# Altium project DragonFly.PrjPcb
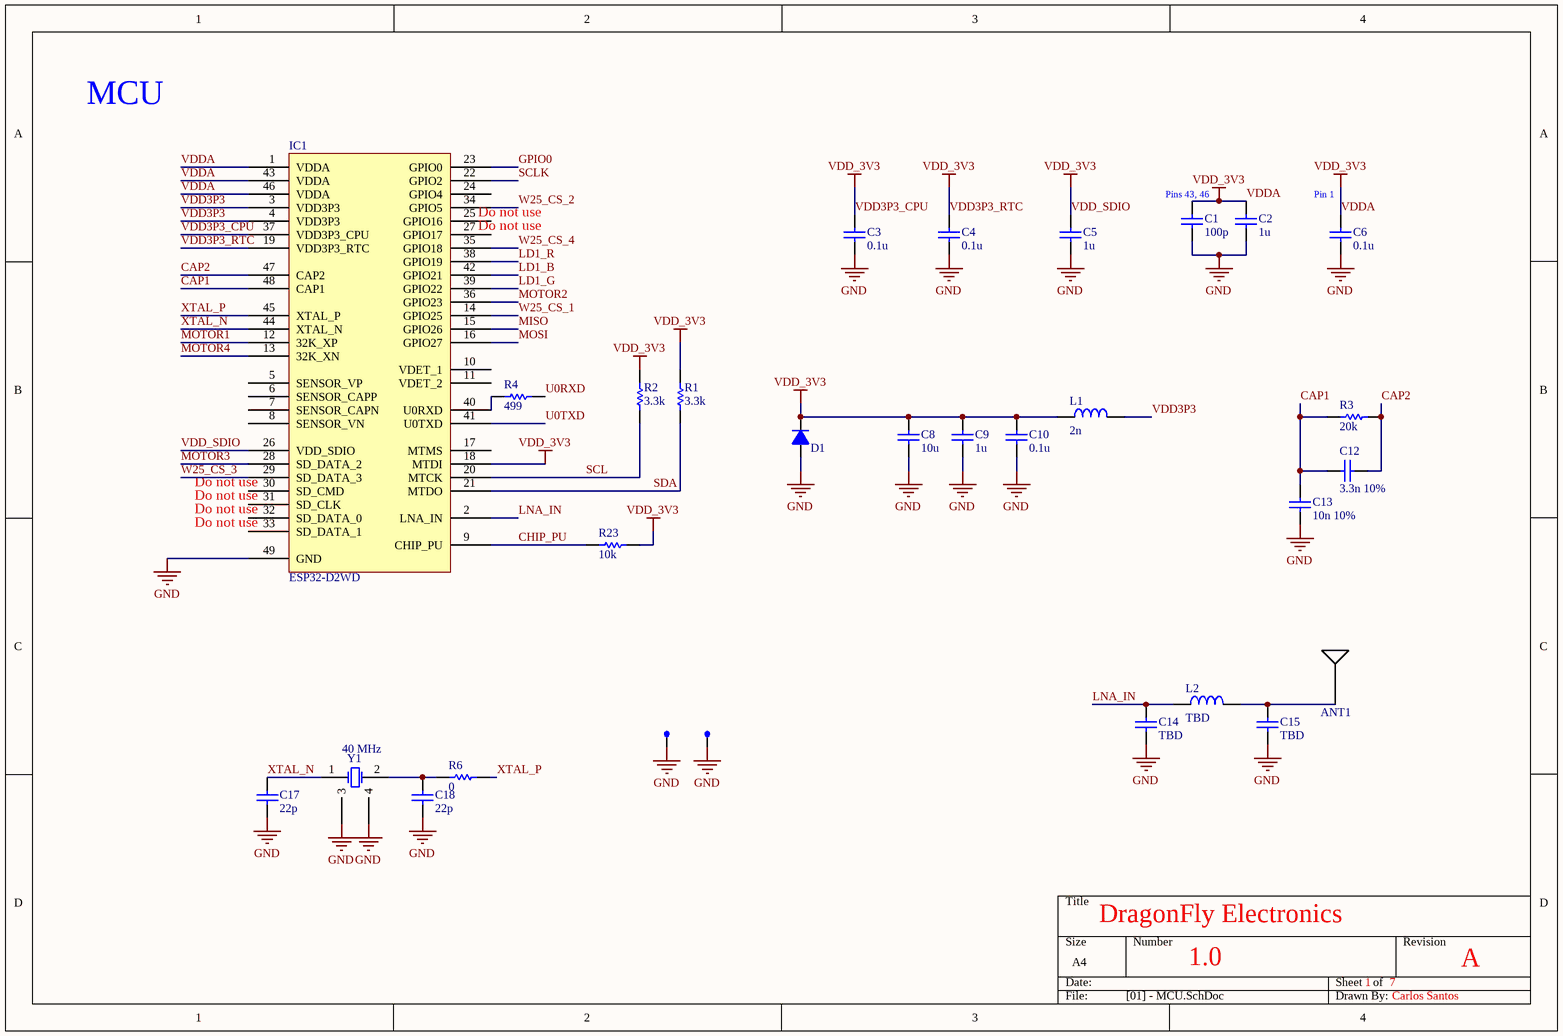
[diagram p0: [01] - MCU.SchDoc]
6 sheets, 112 parts. Net scope: global (net labels, ports and power ports of the same name join across sheets).
Board file: DragonFly.PcbDoc
Sheets:
  [01] - MCU.SchDoc
  [02] - Power.SchDoc
  [04] - USB.SchDoc
  [05] - Motors.SchDoc
  [06] - LEDs.SchDoc
  [07] - Sensors.SchDoc

## Sheet [01] - MCU.SchDoc
size A4

### Parts
(Parts that share a designator on the sheet are numbered #1, #2 ... from top to bottom, then left to right.)
ANT1  2.4 GHz Ant  [2450AT18A100E]  (value not drawn)
C1  value 100p  [0402 - Capacitor]  (hidden comment: Capacitor)
C2  value 1u  [0402 - Capacitor]  (hidden comment: Capacitor)
C3  value 0.1u  [0402 - Capacitor]  (hidden comment: Capacitor)
C4  value 0.1u  [0402 - Capacitor]  (hidden comment: Capacitor)
C5  value 1u  [0402 - Capacitor]  (hidden comment: Capacitor)
C6  value 0.1u  [0402 - Capacitor]  (hidden comment: Capacitor)
C8  value 10u  [0603 - Capacitor]  (hidden comment: Capacitor)
C9  value 1u  [0402 - Capacitor]  (hidden comment: Capacitor)
C10  value 0.1u  [0402 - Capacitor]  (hidden comment: Capacitor)
C12  value 3.3n 10%  [0402 - Capacitor]  (hidden comment: Capacitor)
C13  value 10n 10%  [0402 - Capacitor]  (hidden comment: Capacitor)
C14  value TBD  [0402 - Capacitor]  (hidden comment: Capacitor)
C15  value TBD  [0402 - Capacitor]  (hidden comment: Capacitor)
C17  value 22p  [0402 - Capacitor]  (hidden comment: Capacitor)
C18  value 22p  [0402 - Capacitor]  (hidden comment: Capacitor)
D1  Diode  [SOD 923]  (value not drawn)
IC1  ESP32-D2WD  [ESP32 QFN35P500X500X90_HS-49N]
L1  value 2n  [0402 - inductor]  (hidden comment: Inductor)
L2  value TBD  [0402 - inductor]  (hidden comment: Inductor)
R1  value 3.3k  [0402 - Resistor]  (hidden comment: Resistor)
R2  value 3.3k  [0402 - Resistor]  (hidden comment: Resistor)
R3  value 20k  [0402 - Resistor]  (hidden comment: Resistor)
R4  value 499  [0402 - Resistor]  (hidden comment: Resistor)
R6  value 0  [0402 - Resistor]  (hidden comment: Resistor)
R23  value 10k  [0402 - Resistor]  (hidden comment: Resistor)
SP1#1  Signal Point  [Signal_point_1mm]  (value not drawn)
SP2#1  Signal Point  [Signal_point_1mm]  (value not drawn)
Y1  value 40 MHz  [XTAL 1.6X1.2MM 4-SMD]  (hidden comment: XTAL_4)

### Nets
GND: C1.1 C2.1 C3.1 C4.1 C5.1 C6.1 C8.1 C9.1 C10.1 C13.1 C14.1 C15.1 C17.1 C18.1 D1.1(A) IC1.49(GND) SP1#1.0(VIN) SP2#1.0(VIN) Y1.3 Y1.4
VDD3P3_CPU: C1.2 C2.2 C3.2 C4.2 C5.2 C6.2 C8.2 C9.2 C10.2 D1.2(K) IC1.1(VDDA) IC1.18(MTDI) IC1.19(VDD3P3_RTC) IC1.26(VDD_SDIO) IC1.37(VDD3P3_CPU) IC1.43(VDDA) IC1.46(VDDA) L1.1 R1.2 R2.2 R23.1  [also labelled VDD3P3_RTC, VDD_3V3, VDD_SDIO, VDDA]
CAP1: C12.2 C13.2 IC1.48(CAP1) R3.2
CAP2: C12.1 IC1.47(CAP2) R3.1
CHIP_PU: IC1.9(CHIP_PU) R23.2
GPIO0: IC1.23(GPIO0)
LD1_B: IC1.42(GPIO21)
LD1_G: IC1.39(GPIO22)
LD1_R: IC1.38(GPIO19)
LNA_IN: C14.2 IC1.2(LNA_IN) L2.1
MISO: IC1.15(GPIO26)
MOSI: IC1.16(GPIO27)
MOTOR1: IC1.12(32K_XP)
MOTOR2: IC1.36(GPIO23)
MOTOR3: IC1.28(SD_DATA_2)
MOTOR4: IC1.13(32K_XN)
SCL: IC1.20(MTCK) R2.1
SCLK: IC1.22(GPIO2)
SDA: IC1.21(MTDO) R1.1
U0RXD: R4.1
U0TXD: IC1.41(U0TXD)
VDD3P3: IC1.3(VDD3P3) IC1.4(VDD3P3) L1.2
W25_CS_1: IC1.14(GPIO25)
W25_CS_2: IC1.34(GPIO5)
W25_CS_3: IC1.29(SD_DATA_3)
W25_CS_4: IC1.35(GPIO18)
XTAL_N: C17.2 IC1.44(XTAL_N) Y1.1(OSC1)
XTAL_P: IC1.45(XTAL_P) R6.1
NetANT1_1: ANT1.1 C15.2 L2.2
NetC18_2: C18.2 R6.2 Y1.2(OSC2)
NetIC1_40: IC1.40(U0RXD) R4.2

Not connected (* = marked no-connect by the designer): IC1 5(SENSOR_VP) 6(SENSOR_CAPP) 7(SENSOR_CAPN) 8(SENSOR_VN) 10(VDET_1) 11(VDET_2) 17(MTMS) 24(GPIO4) 25(GPIO16) 27(GPIO17) 30(SD_CMD) 31(SD_CLK) 32(SD_DATA_0) 33(SD_DATA_1)

### Notes on the sheet
- MCU
- (near IC1) Do not use
- (near C1) Pins 43, 46
- (near C6) Pin 1
- DragonFly Electronics
- 1.0
- 1
- 7
- A
- Carlos Santos

### Library data of the parts
ANT1 = 2.4 GHz Ant: 2.4GHz Chip RF Antenna 2.4GHz
SP1#1 SP2#1 = Signal Point: Value: DNP
D1 = Diode: DigiKey Part #: ESD9X5.0ST5GOSCT-ND
IC1 = ESP32-D2WD: DigiKey Part #: 1904-1005-1-ND
Y1 = XTAL_4: DigiKey Part #: 535-13987-1-ND

## Sheet [02] - Power.SchDoc
size A4
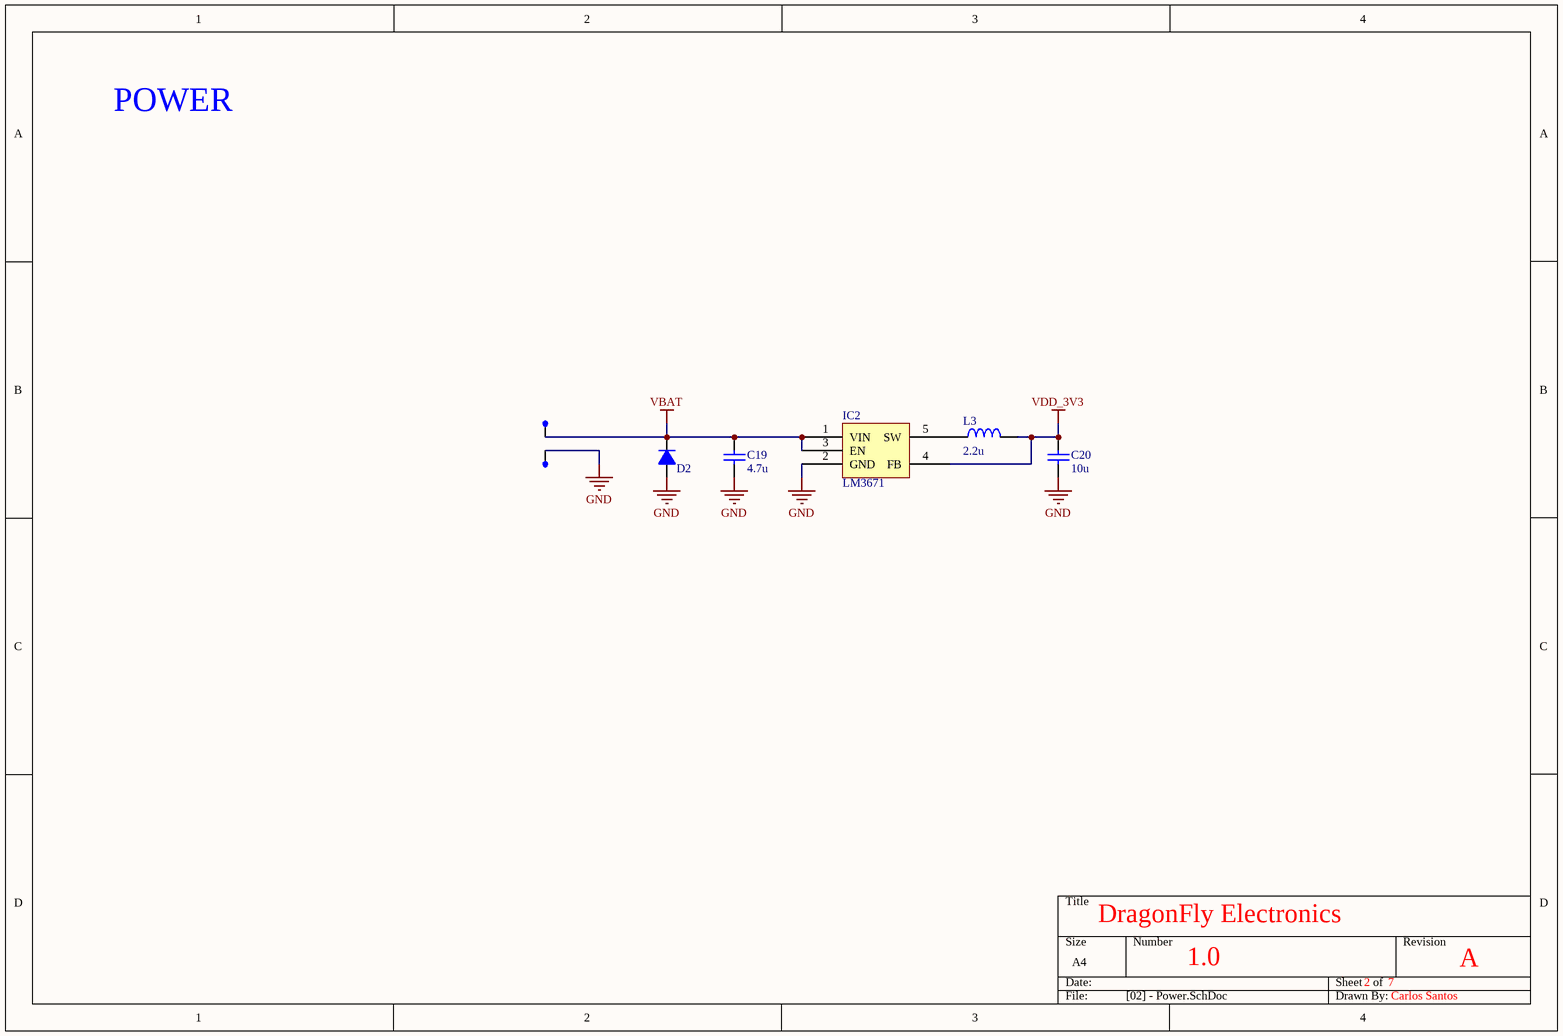
[diagram p1: [02] - Power.SchDoc]

### Parts
C19  value 4.7u  [0402 - Capacitor]  (hidden comment: Capacitor)
C20  value 10u  [0603 - Capacitor]  (hidden comment: Capacitor)
D2  Diode  [SOD 923]  (value not drawn)
IC2  LM3671  [SOT 23 - 5]
L3  value 2.2u  [MDMK2020]  (hidden comment: Inductor)
SP15  Signal Point  [Signal_point_1mm]  (value not drawn)
SP16  Signal Point  [Signal_point_1mm]  (value not drawn)

### Nets
GND: C19.1 C20.1 D2.1(A) IC2.2(GND) SP16.0(VIN)
VBAT: C19.2 D2.2(K) IC2.1(VIN) IC2.3(EN) SP15.0(VIN)
VDD_3V3: C20.2 IC2.4(FB) L3.2  [project net VDD3P3_CPU]
NetIC2_5: IC2.5(SW) L3.1

### Notes on the sheet
- POWER
- DragonFly Electronics
- 1.0
- 2
- 7
- A
- Carlos Santos

### Library data of the parts
SP15 SP16 = Signal Point: Value: DNP
D2 = Diode: DigiKey Part #: *
IC2 = LM3671: DigiKey Part #: LM3671MF-3.3/NOPBCT-ND

## Sheet [04] - USB.SchDoc
size A4
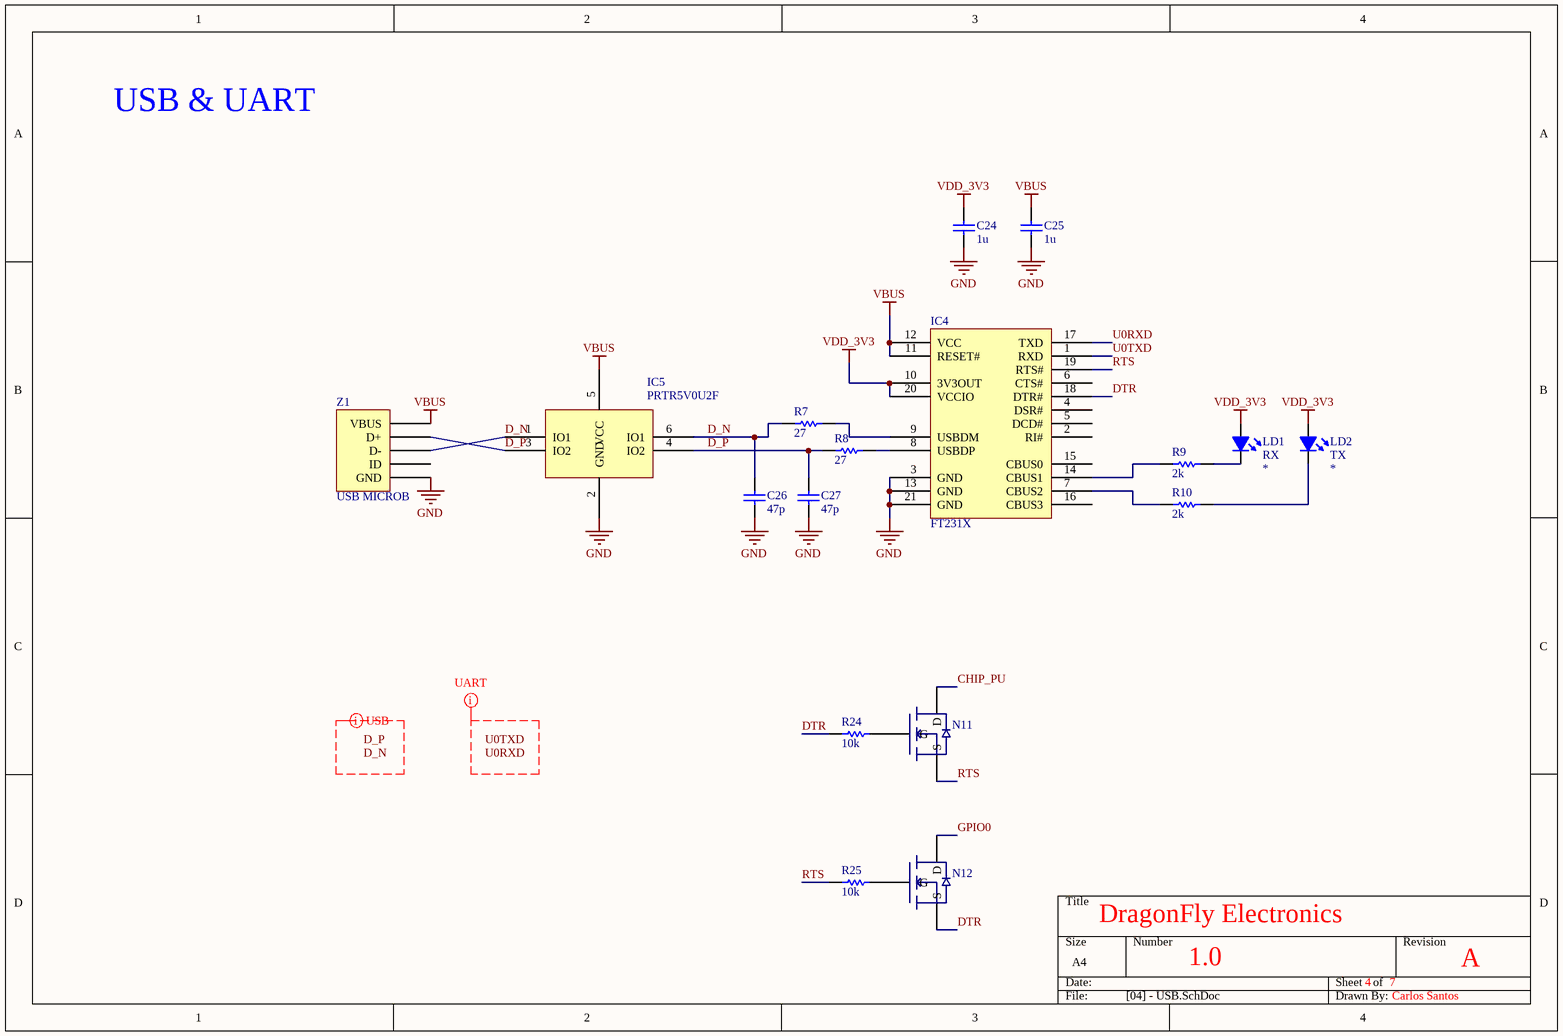
[diagram p2: [04] - USB.SchDoc]

### Parts
C24  value 1u  [0402 - Capacitor]  (hidden comment: Capacitor)
C25  value 1u  [0402 - Capacitor]  (hidden comment: Capacitor)
C26  value 47p  [0402 - Capacitor]  (hidden comment: Capacitor)
C27  value 47p  [0402 - Capacitor]  (hidden comment: Capacitor)
IC4  FT231X  [QFN20-127P600-8N]
IC5  PRTR5V0U2F  [SOT886]
LD1  Color: RX  [0402 - Led]  (hidden comment: Led)
LD2  Color: TX  [0402 - Led]  (hidden comment: Led)
N11  N-MOSFET  [DFN1006-3]  (value not drawn)
N12  N-MOSFET  [DFN1006-3]  (value not drawn)
R7  value 27  [0402 - Resistor]  (hidden comment: Resistor)
R8  value 27  [0402 - Resistor]  (hidden comment: Resistor)
R9  value 2k  [0402 - Resistor]  (hidden comment: Resistor)
R10  value 2k  [0402 - Resistor]  (hidden comment: Resistor)
R24  value 10k  [0402 - Resistor]  (hidden comment: Resistor)
R25  value 10k  [0402 - Resistor]  (hidden comment: Resistor)
Z1  USB MICROB  [USB - microB]

### Nets
GND: C24.1 C25.1 C26.1 C27.1 IC4.3(GND) IC4.13(GND) IC4.21(GND) IC5.2(GND) Z1.5(GND)
VBUS: C25.2 IC4.11(RESET#) IC4.12(VCC) IC5.5(VCC) Z1.1(VBUS)
VDD_3V3: C24.2 IC4.10(3V3OUT) IC4.20(VCCIO) LD1.1(A) LD2.1(A)  [project net VDD3P3_CPU]
CHIP_PU: N11.3(D)
D_N: C26.2 IC5.1(IO1) IC5.6(IO1) R7.1 Z1.2(D-)
D_P: C27.2 IC5.3(IO2) IC5.4(IO2) R8.1 Z1.3(D+)
DTR: IC4.18(DTR#) N12.1(S) R24.1
GPIO0: N12.3(D)
RTS: IC4.19(RTS#) N11.1(S) R25.1
U0RXD: IC4.17(TXD)
U0TXD: IC4.1(RXD)
NetIC4_7: IC4.7(CBUS2) R10.1
NetIC4_8: IC4.8(USBDP) R8.2
NetIC4_9: IC4.9(USBDM) R7.2
NetIC4_14: IC4.14(CBUS1) R9.1
NetLD1_2: LD1.2(K) R9.2
NetLD2_2: LD2.2(K) R10.2
NetN11_2: N11.2(G) R24.2
NetN12_2: N12.2(G) R25.2

Not connected (* = marked no-connect by the designer): IC4 2(RI#) 4(DSR#) 5(DCD#) 6(CTS#) 15(CBUS0) 16(CBUS3); Z1 4(ID)

### Layout directives
net class UART: U0RXD, U0TXD
differential pair: D_N, D_P

### Notes on the sheet
- USB & UART
- DragonFly Electronics
- 1.0
- 4
- 7
- A
- Carlos Santos
- Labels drawn without touching a wire or pin: D_N, D_P, U0RXD, U0TXD

### Library data of the parts
Z1 = USB - microB: 609-4613-1-ND; DigiKey Part #: 609-4613-1-ND
IC4 = FT231X: DigiKey Part #: 768-1128-1-ND
IC5 = PRTR5V0U2F: DigiKey Part #: 1727-4161-6-ND
LD1 LD2 = Led: Vf: *

## Sheet [05] - Motors.SchDoc
size A4
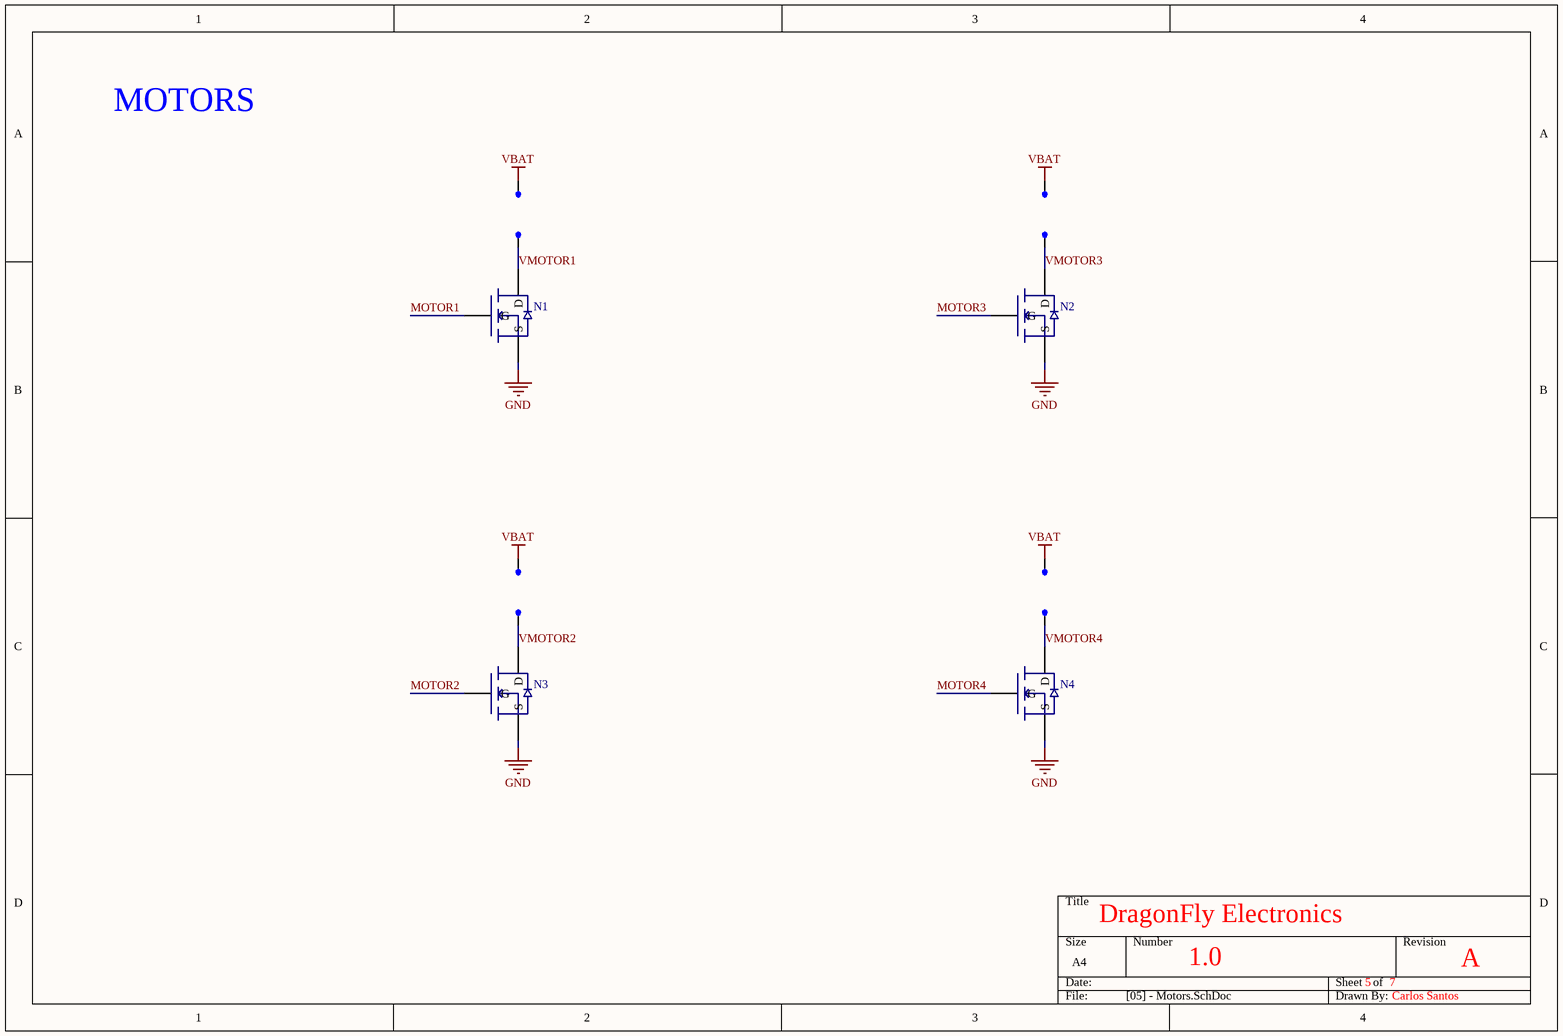
[diagram p3: [05] - Motors.SchDoc]

### Parts
(Parts that share a designator on the sheet are numbered #1, #2 ... from top to bottom, then left to right.)
N1  N-MOSFET  [DFN1006-3]  (value not drawn)
N2  N-MOSFET  [DFN1006-3]  (value not drawn)
N3  N-MOSFET  [DFN1006-3]  (value not drawn)
N4  N-MOSFET  [DFN1006-3]  (value not drawn)
SP1#2  Signal Point  [Signal_point_2mm]  (value not drawn)
SP2#2  Signal Point  [Signal_point_2mm]  (value not drawn)
SP3  Signal Point  [Signal_point_2mm]  (value not drawn)
SP4  Signal Point  [Signal_point_2mm]  (value not drawn)
SP5  Signal Point  [Signal_point_2mm]  (value not drawn)
SP6  Signal Point  [Signal_point_2mm]  (value not drawn)
SP7  Signal Point  [Signal_point_2mm]  (value not drawn)
SP8  Signal Point  [Signal_point_2mm]  (value not drawn)

### Nets
GND: N1.1(S) N2.1(S) N3.1(S) N4.1(S)
VBAT: SP1#2.0(VIN) SP2#2.0(VIN) SP5.0(VIN) SP6.0(VIN)
MOTOR1: N1.2(G)
MOTOR2: N3.2(G)
MOTOR3: N2.2(G)
MOTOR4: N4.2(G)
VMOTOR1: N1.3(D) SP3.0(VIN)
VMOTOR2: N3.3(D) SP7.0(VIN)
VMOTOR3: N2.3(D) SP4.0(VIN)
VMOTOR4: N4.3(D) SP8.0(VIN)

### Notes on the sheet
- MOTORS
- DragonFly Electronics
- 1.0
- 5
- 7
- A
- Carlos Santos

### Library data of the parts
SP1#2 SP2#2 SP3-SP8 = Signal Point: Value: DNP
N1-N4 = N-MOSFET: DigiKey Part #: 1727-2316-1-ND

## Sheet [06] - LEDs.SchDoc
size A4
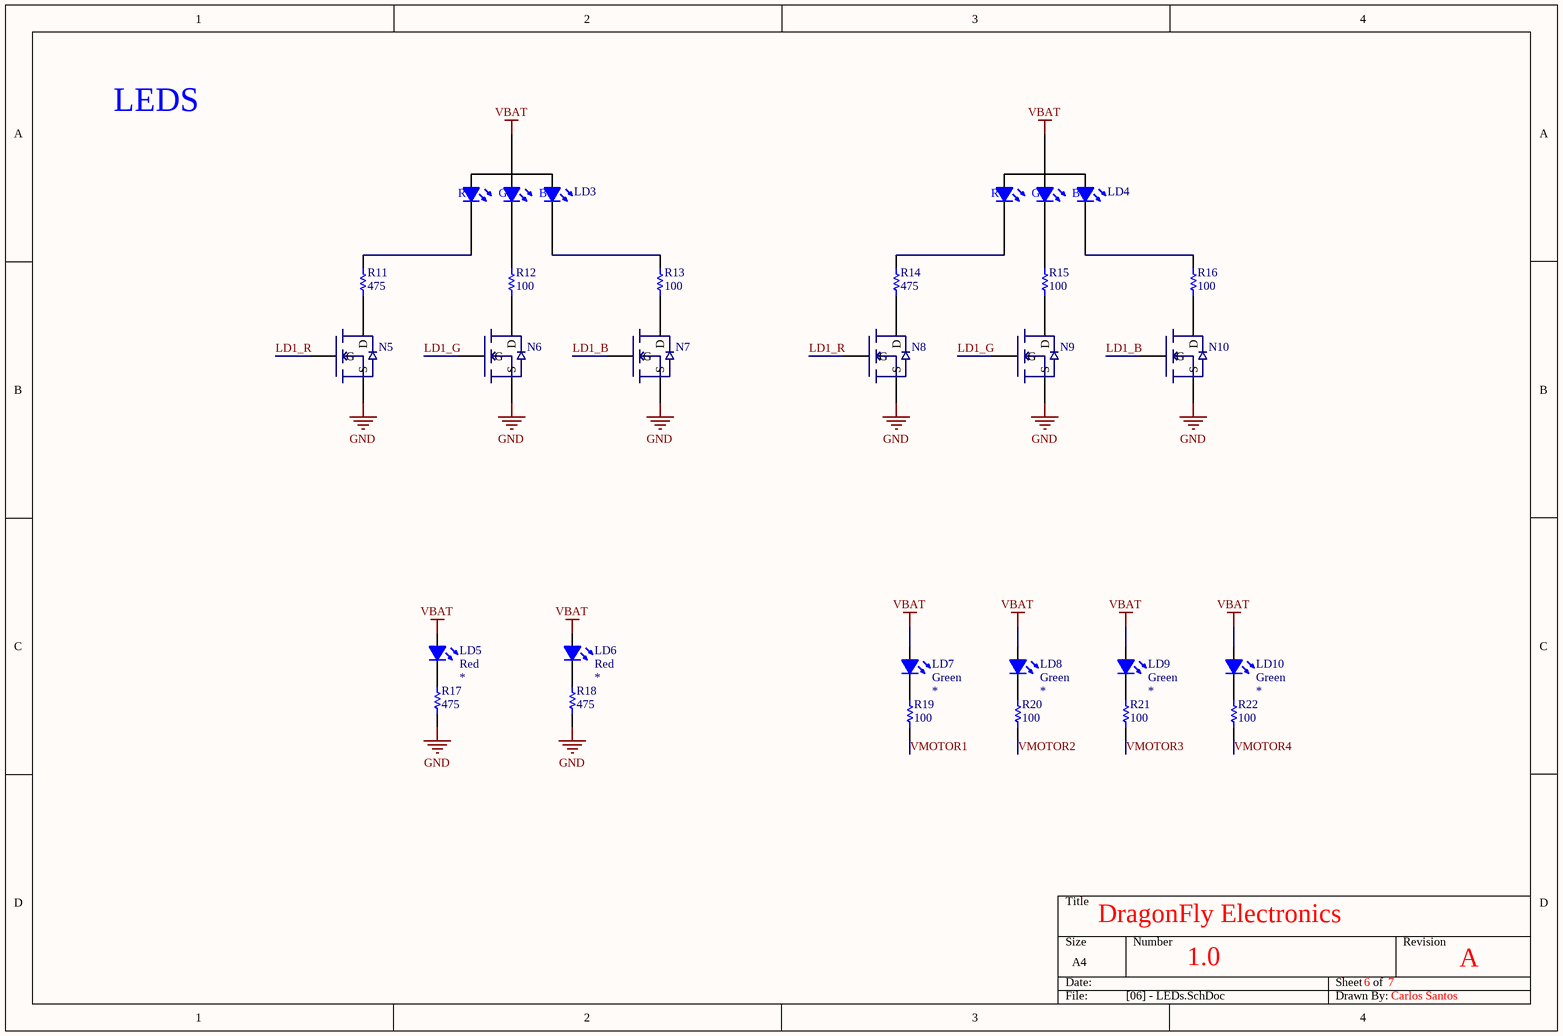
[diagram p4: [06] - LEDs.SchDoc]

### Parts
LD3  1  [0404 RGD Led]  (value not drawn)
LD4  1  [0404 RGD Led]  (value not drawn)
LD5  Color: Red  [0603 - led]  (hidden comment: Led)
LD6  Color: Red  [0603 - led]  (hidden comment: Led)
LD7  Color: Green  [0603 - led]  (hidden comment: Led)
LD8  Color: Green  [0603 - led]  (hidden comment: Led)
LD9  Color: Green  [0603 - led]  (hidden comment: Led)
LD10  Color: Green  [0603 - led]  (hidden comment: Led)
N5  N-MOSFET  [DFN1006-3]  (value not drawn)
N6  N-MOSFET  [DFN1006-3]  (value not drawn)
N7  N-MOSFET  [DFN1006-3]  (value not drawn)
N8  N-MOSFET  [DFN1006-3]  (value not drawn)
N9  N-MOSFET  [DFN1006-3]  (value not drawn)
N10  N-MOSFET  [DFN1006-3]  (value not drawn)
R11  value 475  [0402 - Resistor]  (hidden comment: Resistor)
R12  value 100  [0402 - Resistor]  (hidden comment: Resistor)
R13  value 100  [0402 - Resistor]  (hidden comment: Resistor)
R14  value 475  [0402 - Resistor]  (hidden comment: Resistor)
R15  value 100  [0402 - Resistor]  (hidden comment: Resistor)
R16  value 100  [0402 - Resistor]  (hidden comment: Resistor)
R17  value 475  [0402 - Resistor]  (hidden comment: Resistor)
R18  value 475  [0402 - Resistor]  (hidden comment: Resistor)
R19  value 100  [0402 - Resistor]  (hidden comment: Resistor)
R20  value 100  [0402 - Resistor]  (hidden comment: Resistor)
R21  value 100  [0402 - Resistor]  (hidden comment: Resistor)
R22  value 100  [0402 - Resistor]  (hidden comment: Resistor)

### Nets
GND: N5.1(S) N6.1(S) N7.1(S) N8.1(S) N9.1(S) N10.1(S) R17.1 R18.1
VBAT: LD3.1(A) LD4.1(A) LD5.1(A) LD6.1(A) LD7.1(A) LD8.1(A) LD9.1(A) LD10.1(A)
LD1_B: N7.2(G) N10.2(G)
LD1_G: N6.2(G) N9.2(G)
LD1_R: N5.2(G) N8.2(G)
VMOTOR1: R19.1
VMOTOR2: R20.1
VMOTOR3: R21.1
VMOTOR4: R22.1
NetLD3_2: LD3.2(K) R11.2
NetLD3_3: LD3.3 R12.2
NetLD3_4: LD3.4 R13.2
NetLD4_2: LD4.2(K) R14.2
NetLD4_3: LD4.3 R15.2
NetLD4_4: LD4.4 R16.2
NetLD5_2: LD5.2(K) R17.2
NetLD6_2: LD6.2(K) R18.2
NetLD7_2: LD7.2(K) R19.2
NetLD8_2: LD8.2(K) R20.2
NetLD9_2: LD9.2(K) R21.2
NetLD10_2: LD10.2(K) R22.2
NetN5_3: N5.3(D) R11.1
NetN6_3: N6.3(D) R12.1
NetN7_3: N7.3(D) R13.1
NetN8_3: N8.3(D) R14.1
NetN9_3: N9.3(D) R15.1
NetN10_3: N10.3(D) R16.1

### Notes on the sheet
- LEDS
- DragonFly Electronics
- 1.0
- 6
- 7
- A
- Carlos Santos
- (in symbol RGB LED) R; G; B

### Library data of the parts
LD3 LD4 = RGB LED: DigiKey Part #: 475-3597-1-ND
LD5-LD10 = Led: Vf: *

## Sheet [07] - Sensors.SchDoc
size A4
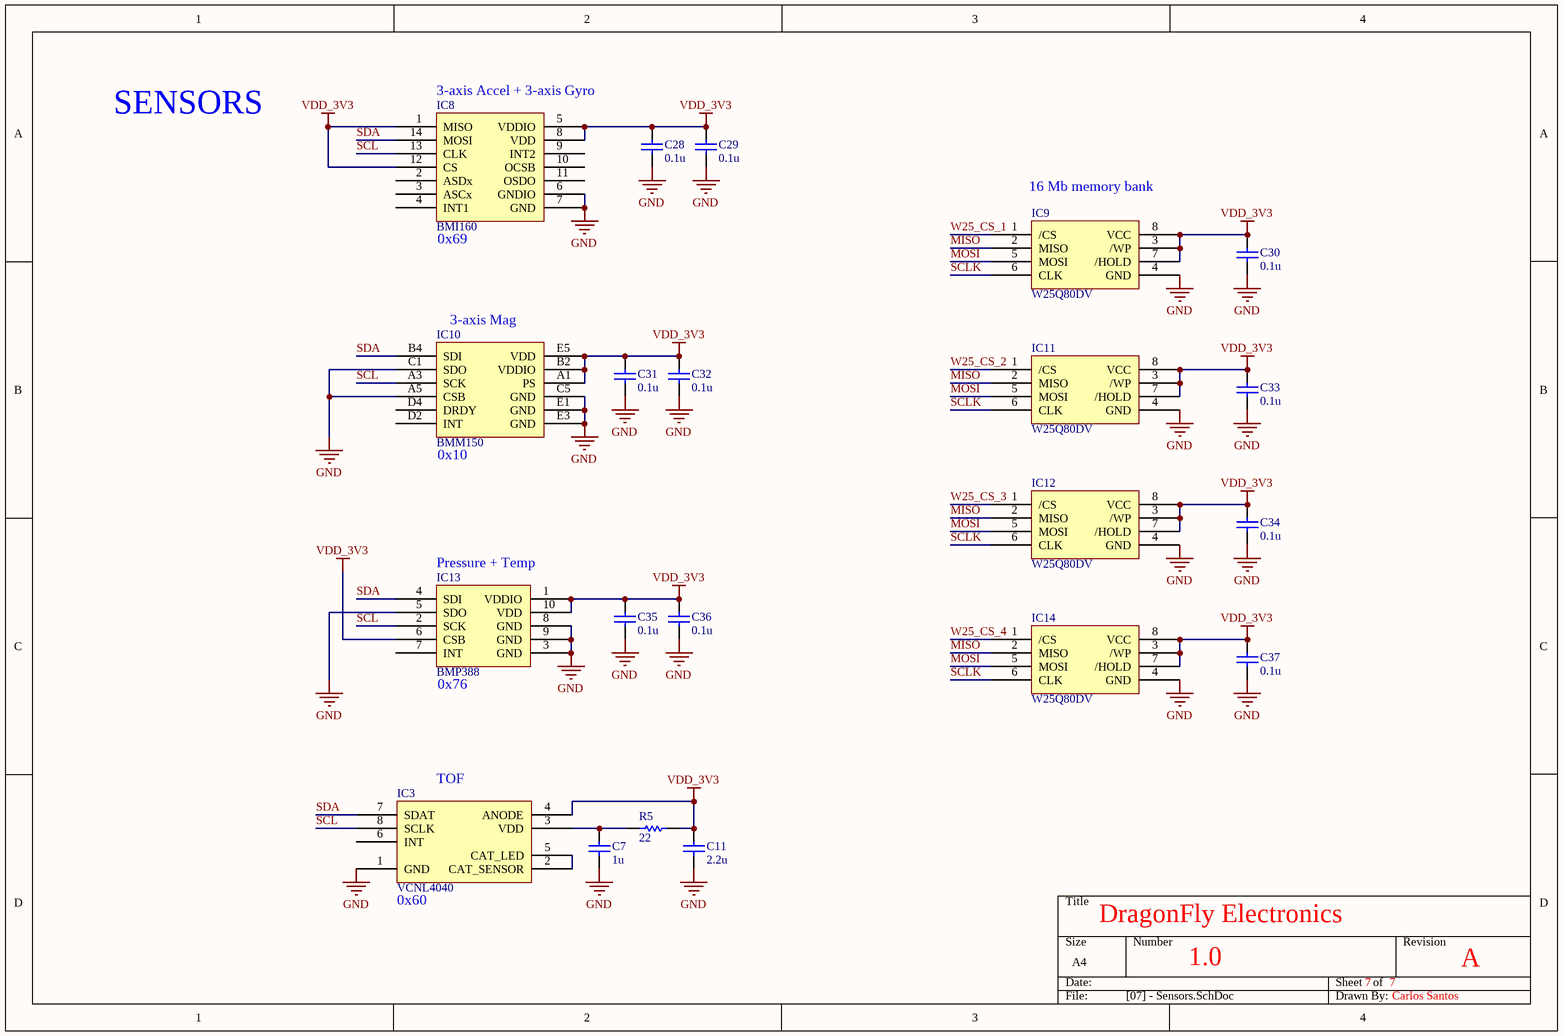
[diagram p5: [07] - Sensors.SchDoc]

### Parts
C7  value 1u  [0402 - Capacitor]  (hidden comment: Capacitor)
C11  value 2.2u  [0402 - Capacitor]  (hidden comment: Capacitor)
C28  value 0.1u  [0402 - Capacitor]  (hidden comment: Capacitor)
C29  value 0.1u  [0402 - Capacitor]  (hidden comment: Capacitor)
C30  value 0.1u  [0402 - Capacitor]  (hidden comment: Capacitor)
C31  value 0.1u  [0402 - Capacitor]  (hidden comment: Capacitor)
C32  value 0.1u  [0402 - Capacitor]  (hidden comment: Capacitor)
C33  value 0.1u  [0402 - Capacitor]  (hidden comment: Capacitor)
C34  value 0.1u  [0402 - Capacitor]  (hidden comment: Capacitor)
C35  value 0.1u  [0402 - Capacitor]  (hidden comment: Capacitor)
C36  value 0.1u  [0402 - Capacitor]  (hidden comment: Capacitor)
C37  value 0.1u  [0402 - Capacitor]  (hidden comment: Capacitor)
IC3  VCNL4040  [VCNL4040M3OE]
IC8  BMI160  [BMI160]
IC9  W25Q80DV  [8 - Pad USON 2x3mm]
IC10  BMM150  [BMM150]
IC11  W25Q80DV  [8 - Pad USON 2x3mm]
IC12  W25Q80DV  [8 - Pad USON 2x3mm]
IC13  BMP388  [BMP388]
IC14  W25Q80DV  [8 - Pad USON 2x3mm]
R5  value 22  [0402 - Resistor]  (hidden comment: Resistor)

### Nets
GND: C7.1 C11.1 C28.1 C29.1 C30.1 C31.1 C32.1 C33.1 C34.1 C35.1 C36.1 C37.1 IC3.1(GND) IC8.6(GNDIO) IC8.7(GND) IC9.4(GND) IC10.A5(CSB) IC10.C1(SDO) IC10.C5(GND) IC10.E1(GND) IC10.E3(GND) IC11.4(GND) IC12.4(GND) IC13.3(GND) IC13.5(SDO) IC13.8(GND) IC13.9(GND) IC14.4(GND)
VDD_3V3: C11.2 C28.2 C29.2 C30.2 C31.2 C32.2 C33.2 C34.2 C35.2 C36.2 C37.2 IC3.4(ANODE) IC8.1(MISO) IC8.5(VDDIO) IC8.8(VDD) IC8.12(CS) IC9.3(/WP) IC9.7(/HOLD) IC9.8(VCC) IC10.A1(PS) IC10.B2(VDDIO) IC10.E5(VDD) IC11.3(/WP) IC11.7(/HOLD) IC11.8(VCC) IC12.3(/WP) IC12.7(/HOLD) IC12.8(VCC) IC13.1(VDDIO) IC13.6(CSB) IC13.10(VDD) IC14.3(/WP) IC14.7(/HOLD) IC14.8(VCC) R5.2  [project net VDD3P3_CPU]
MISO: IC9.2(MISO) IC11.2(MISO) IC12.2(MISO) IC14.2(MISO)
MOSI: IC9.5(MOSI) IC11.5(MOSI) IC12.5(MOSI) IC14.5(MOSI)
SCL: IC3.8(SCLK) IC8.13(CLK) IC10.A3(SCK) IC13.2(SCK)
SCLK: IC9.6(CLK) IC11.6(CLK) IC12.6(CLK) IC14.6(CLK)
SDA: IC3.7(SDAT) IC8.14(MOSI) IC10.B4(SDI) IC13.4(SDI)
W25_CS_1: IC9.1(/CS)
W25_CS_2: IC11.1(/CS)
W25_CS_3: IC12.1(/CS)
W25_CS_4: IC14.1(/CS)
NetC7_2: C7.2 IC3.3(VDD) R5.1
NetIC3_2: IC3.2(CAT_SENSOR) IC3.5(CAT_LED)

Not connected (* = marked no-connect by the designer): IC3 6(INT); IC8 2(ASDx) 3(ASCx) 4(INT1) 9(INT2) 10(OCSB) 11(OSDO); IC10 D2(INT) D4(DRDY); IC13 7(INT)

### Notes on the sheet
- (near IC8) 3-axis Accel + 3-axis Gyro
- SENSORS
- (near IC8) 0x69
- (near IC9) 16 Mb memory bank
- (near IC10) 3-axis Mag
- (near IC10) 0x10
- (near IC13) Pressure + Temp
- (near IC13) 0x76
- (near IC3) TOF
- (near IC3) 0x60
- DragonFly Electronics
- 1.0
- 7
- A
- Carlos Santos

### Library data of the parts
IC9 IC11 IC12 IC14 = W25X20CL: DigiKey Part #: W25Q80DVUXIECT-ND
IC3 = VCNL4040: DigiKey Part #: VCNL4040M3OECT-ND
IC8 = BMI160: DigiKey Part #: 828-1057-1-ND
IC10 = BMM150: DigiKey Part #: 828-1044-1-ND
IC13 = BMP388: DigiKey Part #: 828-1079-1-ND

## Nets that join several sheets
GND: [01] - MCU (20 pins), [02] - Power (5 pins), [04] - USB (9 pins), [05] - Motors (N1.1 N2.1 N3.1 N4.1), [06] - LEDs (8 pins), [07] - Sensors (28 pins)
VBAT: [02] - Power (5 pins), [05] - Motors (SP1#2.0 SP2#2.0 SP5.0 SP6.0), [06] - LEDs (8 pins)
VDD3P3_CPU: [01] - MCU (21 pins), [02] - Power (C20.2 IC2.4 L3.2), [04] - USB (5 pins), [07] - Sensors (35 pins)
CHIP_PU: [01] - MCU (IC1.9 R23.2), [04] - USB (N11.3)
GPIO0: [01] - MCU (IC1.23), [04] - USB (N12.3)
LD1_B: [01] - MCU (IC1.42), [06] - LEDs (N7.2 N10.2)
LD1_G: [01] - MCU (IC1.39), [06] - LEDs (N6.2 N9.2)
LD1_R: [01] - MCU (IC1.38), [06] - LEDs (N5.2 N8.2)
MISO: [01] - MCU (IC1.15), [07] - Sensors (IC9.2 IC11.2 IC12.2 IC14.2)
MOSI: [01] - MCU (IC1.16), [07] - Sensors (IC9.5 IC11.5 IC12.5 IC14.5)
MOTOR1: [01] - MCU (IC1.12), [05] - Motors (N1.2)
MOTOR2: [01] - MCU (IC1.36), [05] - Motors (N3.2)
MOTOR3: [01] - MCU (IC1.28), [05] - Motors (N2.2)
MOTOR4: [01] - MCU (IC1.13), [05] - Motors (N4.2)
SCL: [01] - MCU (IC1.20 R2.1), [07] - Sensors (IC3.8 IC8.13 IC10.A3 IC13.2)
SCLK: [01] - MCU (IC1.22), [07] - Sensors (IC9.6 IC11.6 IC12.6 IC14.6)
SDA: [01] - MCU (IC1.21 R1.1), [07] - Sensors (IC3.7 IC8.14 IC10.B4 IC13.4)
U0RXD: [01] - MCU (R4.1), [04] - USB (IC4.17)
U0TXD: [01] - MCU (IC1.41), [04] - USB (IC4.1)
VMOTOR1: [05] - Motors (N1.3 SP3.0), [06] - LEDs (R19.1)
VMOTOR2: [05] - Motors (N3.3 SP7.0), [06] - LEDs (R20.1)
VMOTOR3: [05] - Motors (N2.3 SP4.0), [06] - LEDs (R21.1)
VMOTOR4: [05] - Motors (N4.3 SP8.0), [06] - LEDs (R22.1)
W25_CS_1: [01] - MCU (IC1.14), [07] - Sensors (IC9.1)
W25_CS_2: [01] - MCU (IC1.34), [07] - Sensors (IC11.1)
W25_CS_3: [01] - MCU (IC1.29), [07] - Sensors (IC12.1)
W25_CS_4: [01] - MCU (IC1.35), [07] - Sensors (IC14.1)